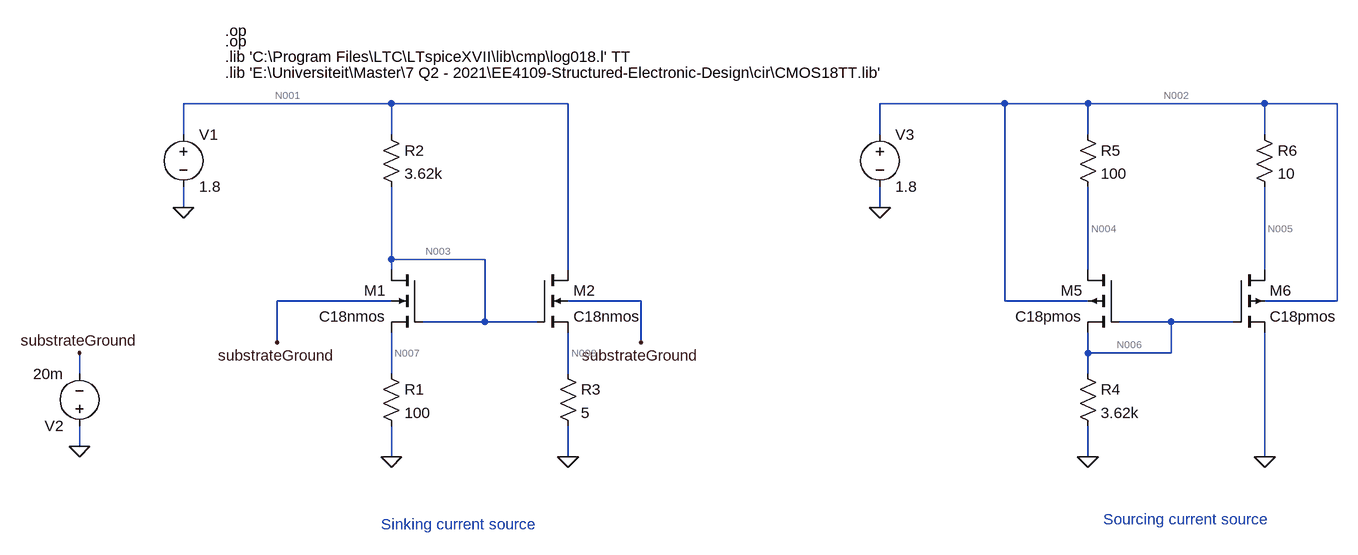
[diagram p0: schematic BiasingCurrentSource.asc]
BiasingCurrentSource.asc, the LTspice schematic file:
Version 4
SHEET 1 1704 680
WIRE 32 -176 -288 -176
WIRE 304 -176 32 -176
WIRE 976 -176 784 -176
WIRE 1104 -176 976 -176
WIRE 1376 -176 1104 -176
WIRE 1488 -176 1376 -176
WIRE -288 -128 -288 -176
WIRE 32 -128 32 -176
WIRE 784 -128 784 -176
WIRE 1104 -128 1104 -176
WIRE 1376 -128 1376 -176
WIRE -288 -16 -288 -48
WIRE 784 -16 784 -48
WIRE 32 64 32 -48
WIRE 176 64 32 64
WIRE 32 80 32 64
WIRE 304 80 304 -176
WIRE 1104 80 1104 -48
WIRE 1376 80 1376 -48
WIRE 32 128 -144 128
WIRE 416 128 304 128
WIRE 976 128 976 -176
WIRE 1104 128 976 128
WIRE 1488 128 1488 -176
WIRE 1488 128 1376 128
WIRE 176 160 176 64
WIRE 176 160 80 160
WIRE 256 160 176 160
WIRE 1232 160 1152 160
WIRE 1328 160 1232 160
WIRE -144 192 -144 128
WIRE 416 192 416 128
WIRE 1104 208 1104 176
WIRE 1232 208 1232 160
WIRE 1232 208 1104 208
WIRE -448 240 -448 208
WIRE 32 240 32 176
WIRE 304 240 304 176
WIRE 1104 240 1104 208
WIRE -448 352 -448 320
WIRE 32 368 32 320
WIRE 304 368 304 320
WIRE 1104 368 1104 320
WIRE 1376 368 1376 176
FLAG 32 368 0
FLAG -288 -16 0
FLAG -448 208 substrateGround
FLAG -448 352 0
FLAG 304 368 0
FLAG 416 192 substrateGround
FLAG -144 192 substrateGround
FLAG 1104 368 0
FLAG 784 -16 0
FLAG 1376 368 0
DATAFLAG -48 0 "Id(M1)"
DATAFLAG 384 0 "Id(M2)"
DATAFLAG 1184 32 "Id(M5)"
DATAFLAG 1584 32 "Id(M6)"
SYMBOL nmos4 80 80 M0
SYMATTR InstName M1
SYMATTR Value C18nmos
SYMATTR Value2 l=360n w=35u m=4
SYMBOL res 16 224 R0
SYMATTR InstName R1
SYMATTR Value 100
SYMBOL res 16 -144 R0
SYMATTR InstName R2
SYMATTR Value 3.62k
SYMBOL voltage -288 -144 R0
WINDOW 123 0 0 Left 0
WINDOW 39 0 0 Left 0
SYMATTR InstName V1
SYMATTR Value 1.8
SYMBOL voltage -448 336 R180
WINDOW 123 0 0 Left 0
WINDOW 39 0 0 Left 0
SYMATTR InstName V2
SYMATTR Value 20m
SYMBOL nmos4 256 80 R0
SYMATTR InstName M2
SYMATTR Value C18nmos
SYMATTR Value2 l=360n w=35u m=80
SYMBOL res 288 224 R0
SYMATTR InstName R3
SYMATTR Value 5
SYMBOL res 1088 224 R0
SYMATTR InstName R4
SYMATTR Value 3.62k
SYMBOL res 1088 -144 R0
SYMATTR InstName R5
SYMATTR Value 100
SYMBOL voltage 784 -144 R0
WINDOW 123 0 0 Left 0
WINDOW 39 0 0 Left 0
SYMATTR InstName V3
SYMATTR Value 1.8
SYMBOL res 1360 -144 R0
SYMATTR InstName R6
SYMATTR Value 10
SYMBOL pmos4 1152 80 M0
SYMATTR InstName M5
SYMATTR Value C18pmos
SYMATTR Value2 l=180n w=40u m=4
SYMBOL pmos4 1328 80 R0
SYMATTR InstName M6
SYMATTR Value C18pmos
SYMATTR Value2 l=180n w=40u m=40
TEXT -224 -272 Left 2 !.op
TEXT -224 -224 Left 2 !.lib 'E:\\Universiteit\\Master\\7 Q2 - 2021\\EE4109-Structured-Electronic-Design\\cir\\CMOS18TT.lib'
TEXT -224 -248 Left 2 !.lib 'C:\\Program Files\\LTC\\LTspiceXVII\\lib\\cmp\\log018.l' TT
TEXT 16 472 Left 2 ;Sinking current source
TEXT 1128 464 Left 2 ;Sourcing current source
TEXT -224 -288 Left 2 !.op

The netlist it stands for:
* BiasingCurrentSource.asc
M1 N003 N003 N007 substrateGround C18nmos l=360n w=35u m=4
R1 N007 0 100
R2 N001 N003 3.62k
V1 N001 0 1.8
V2 0 substrateGround 20m
M2 N001 N003 N008 substrateGround C18nmos l=360n w=35u m=80
R3 N008 0 5
R4 N006 0 3.62k
R5 N002 N004 100
V3 N002 0 1.8
R6 N002 N005 10
M5 N004 N006 N006 N002 C18pmos l=180n w=40u m=4
M6 N005 N006 0 N002 C18pmos l=180n w=40u m=40
.model NMOS NMOS
.model PMOS PMOS
.lib standard.mos
.op
.lib 'E:\Universiteit\Master\7 Q2 - 2021\EE4109-Structured-Electronic-Design\cir\CMOS18TT.lib'
.lib 'C:\Program Files\LTC\LTspiceXVII\lib\cmp\log018.l' TT
* Sinking current source
* Sourcing current source
.op
.backanno
.end

* Results of the author's LTspice run, read from the files saved beside the schematic
* Operating Point:
*   V(n003) = 592.7 mV
*   V(n007) = 33.35 mV
*   V(substrateground) = -20 mV
*   V(n001) = 1.8 V
*   V(n008) = 36.02 mV
*   V(n006) = 1.183 V
*   V(n002) = 1.8 V
*   V(n004) = 1.767 V
*   V(n005) = 1.764 V
*   Id(M6) = 3.606 mA
*   Ig(M6) = 0 A
*   Ib(M6) = 74.14 pA
*   Is(M6) = -3.606 mA
*   Id(M5) = 326.8 µA
*   Ig(M5) = 0 A
*   Ib(M5) = 2.667 pA
*   Is(M5) = -326.8 µA
*   Id(M2) = 7.203 mA
*   Ig(M2) = 0 A
*   Ib(M2) = -151.6 pA
*   Is(M2) = -7.203 mA
*   Id(M1) = 333.5 µA
*   Ig(M1) = 0 A
*   Ib(M1) = -2.739 pA
*   Is(M1) = -333.5 µA
*   I(R6) = 3.606 mA
*   I(R5) = 326.8 µA
*   I(R4) = 326.8 µA
*   I(R3) = 7.203 mA
*   I(R2) = 333.5 µA
*   I(R1) = 333.5 µA
*   I(V3) = -3.933 mA
*   I(V2) = -154.3 pA
*   I(V1) = -7.537 mA
* From the log:
*   Semiconductor Device Operating Points:
*                           --- BSIM3 MOSFETS ---
*   Name:        m3          m2          m1
*   Model:     c18nmos     c18nmos     c18nmos
*   Id:        7.20e-03    3.60e-03    3.34e-04
*   Vgs:       5.57e-01    5.57e-01    5.59e-01
*   Vds:       1.76e+00    1.76e+00    5.59e-01
*   Vbs:      -5.60e-02   -5.60e-02   -5.34e-02
*   Vth:       4.84e-01    4.84e-01    4.83e-01
*   Vdsat:     7.96e-02    7.96e-02    8.12e-02
*   Gm:        1.30e-01    6.52e-02    6.15e-03
*   Gds:       3.46e-03    1.73e-03    2.72e-05
*   Gmb        3.43e-02    1.71e-02    1.62e-03
*   Cbd:       0.00e+00    0.00e+00    0.00e+00
*   Cbs:       0.00e+00    0.00e+00    0.00e+00
*   Cgsov:     1.96e-12    9.78e-13    9.78e-14
*   Cgdov:     1.96e-12    9.78e-13    9.78e-14
*   Cgbov:     2.70e-17    1.35e-17    1.35e-18
*   dQgdVgb:   1.01e-11    5.03e-12    5.06e-13
*   dQgdVdb:  -1.96e-12   -9.78e-13   -9.78e-14
*   dQgdVsb:  -7.46e-12   -3.73e-12   -3.76e-13
*   dQddVgb:  -4.30e-12   -2.15e-12   -2.16e-13
*   dQddVdb:   1.96e-12    9.78e-13    9.79e-14
*   dQddVsb:   3.03e-12    1.51e-12    1.53e-13
*   dQbdVgb:  -1.47e-12   -7.35e-13   -7.31e-14
*   dQbdVdb:   2.20e-17    1.10e-17   -4.95e-17
*   dQbdVsb:  -5.46e-13   -2.73e-13   -2.78e-14